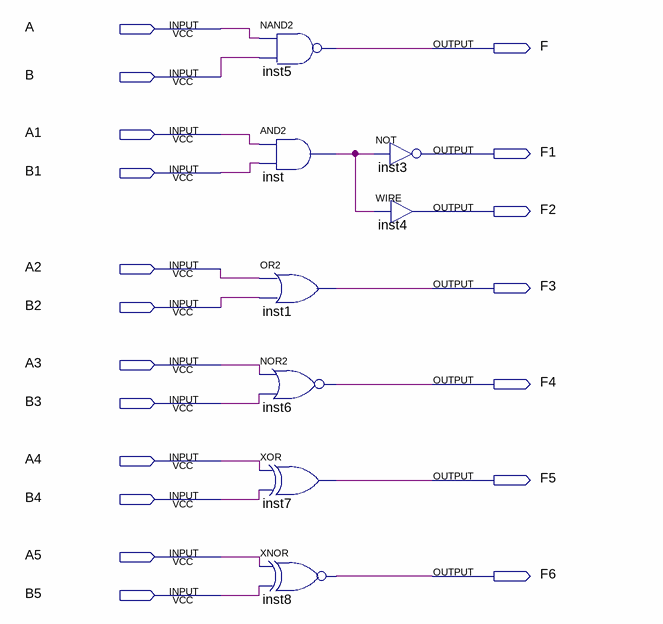
[diagram p0: schematic sheet]
// Quartus schematic NAND_2.bdf as structural Verilog: 8 symbols, 19 pins
module NAND_2 (
  input  A,
  input  B,
  input  A1,
  input  B1,
  input  A2,
  input  B2,
  input  A3,
  input  B3,
  input  A4,
  input  B4,
  input  A5,
  input  B5,
  output F,
  output F1,
  output F2,
  output F3,
  output F4,
  output F5,
  output F6
);

  wire inst_out;

  nand inst5 (F, A, B);
  and inst (inst_out, A1, B1);
  or inst1 (F3, A2, B2);
  nor inst6 (F4, A3, B3);
  xor inst7 (F5, A4, B4);
  xnor inst8 (F6, A5, B5);
  not inst3 (F1, inst_out);
  assign F2 = inst_out;  // WIRE inst4
endmodule
